# EAGLE design integrated_v3 (EAGLE 9.6.2)
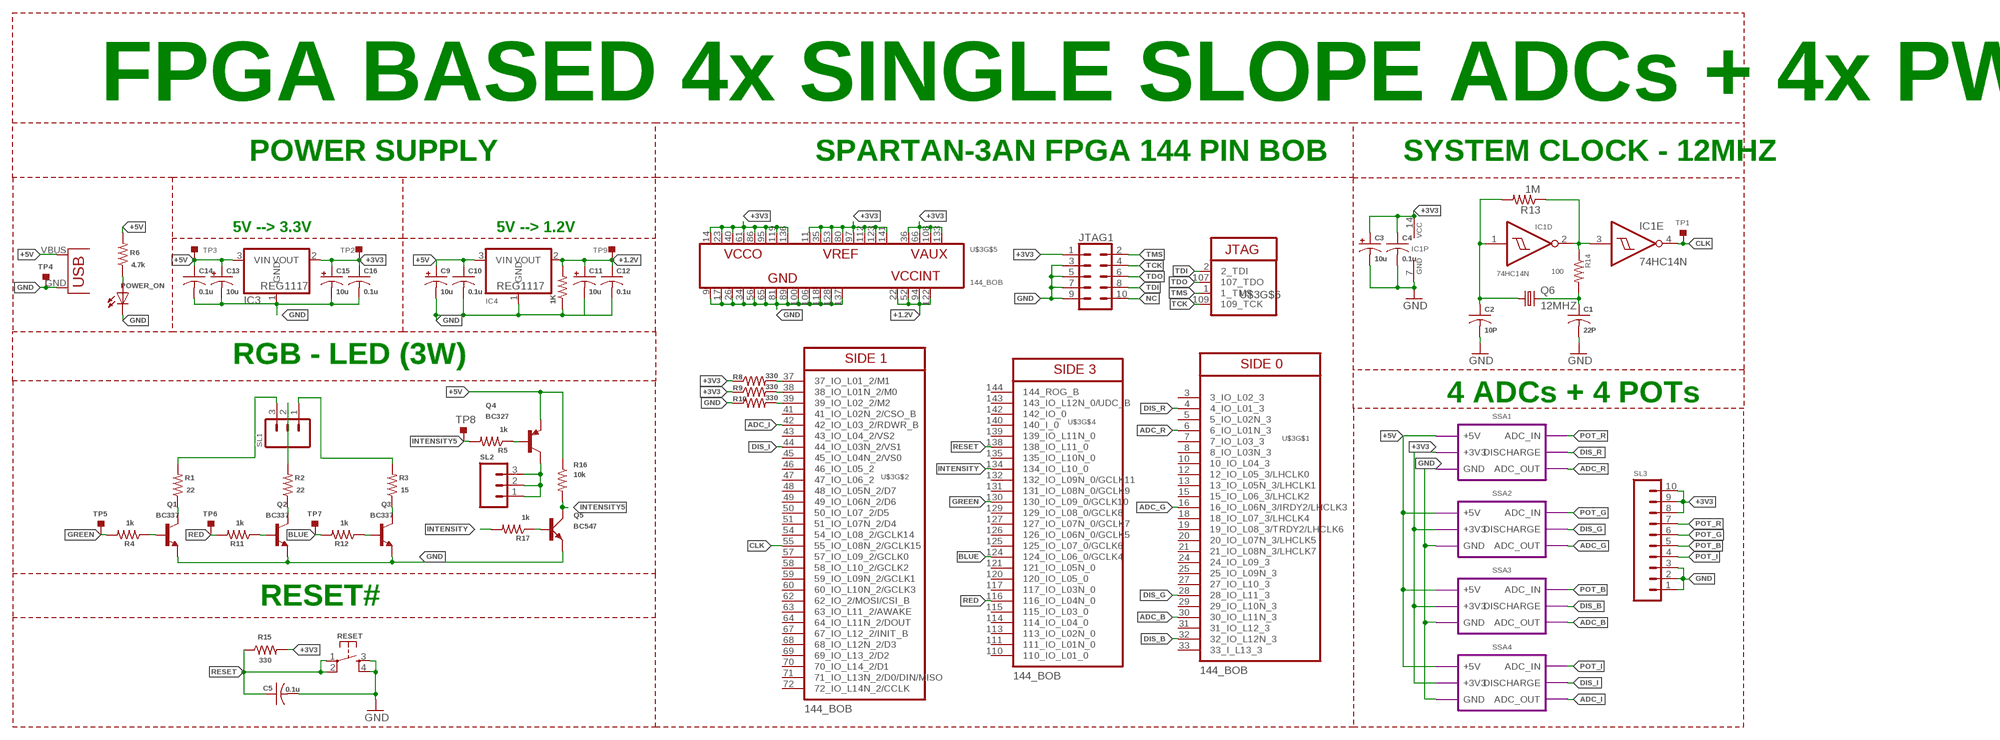
[diagram p0: schematic, sheet 1]

## Parts
1K  R-US_0204/7  [0204/7]
C1  22P  CAP0603  [C0603]
C2  10P  CAP0603  [C0603]
C3  10u  CAP_POL_16V  [B/3528-21R]
C4  0.1u  CAP0603  [C0603]
C5  0.1u  CAP0603  [C0603]
C9  10u  CAP_POL_16V  [B/3528-21R]
C10  0.1u  CAP0603  [C0603]
C11  10u  CAP_POL_16V  [B/3528-21R]
C12  0.1u  CAP0603  [C0603]
C13  10u  CAP_POL_16V  [B/3528-21R]
C14  0.1u  CAP0603  [C0603]
C15  10u  CAP_POL_16V  [B/3528-21R]
C16  0.1u  CAP0603  [C0603]
IC1  74HC14N  [DIL14]
IC3  REG1117  [SOT223]
IC4  REG1117  [SOT223]
JTAG1  CONN_05X2  [2X5-SHROUDED_LOCK_PROPER]
POWER_ON  LED3MM  [LED3MM]
Q1  BC337  [TO92]
Q2  BC337  [TO92]
Q3  BC337  [TO92]
Q4  BC327  [TO92]
Q5  BC547  [SOT54A]
Q6  12MHZ  CRYSTALHC49US  [HC49US]
R1  22  R-US_0411/15  [0411/15]
R2  22  R-US_0411/15  [0411/15]
R3  15  R-US_0411/15  [0411/15]
R4  1k  R-US_0204/7  [0204/7]
R5  1k  R-US_0204/7  [0204/7]
R6  4.7k  R-US_0204/7  [0204/7]
R8  330  RESISTOR0805  [R0805]
R9  330  RESISTOR0805  [R0805]
R10  330  RESISTOR0805  [R0805]
R11  1k  R-US_0204/7  [0204/7]
R12  1k  R-US_0204/7  [0204/7]
R13  1M  R-US_M0805  [M0805]
R14  100  R-US_M0805  [M0805]
R15  330  R-US_0204/7  [0204/7]
R16  10k  R-US_0204/7  [0204/7]
R17  1k  R-US_0204/7  [0204/7]
RESET  10xx  OMRON_SWITCH_10-XX  [B3F-10XX]
SL1  M03  [03P]
SL2  M03  [03P]
SL3  M10  [10P]
TP1  TESTPOINT_TPS-SMD-10SN  [TESTPOINT_SMD-10SN]
TP2  TESTPOINT_TPS-SMD-10SN  [TESTPOINT_SMD-10SN]
TP3  TESTPOINT_TPS-SMD-10SN  [TESTPOINT_SMD-10SN]
TP4  TESTPOINT_TPS-SMD-10SN  [TESTPOINT_SMD-10SN]
TP5  TESTPOINT_TPS-SMD-10SN  [TESTPOINT_SMD-10SN]
TP6  TESTPOINT_TPS-SMD-10SN  [TESTPOINT_SMD-10SN]
TP7  TESTPOINT_TPS-SMD-10SN  [TESTPOINT_SMD-10SN]
TP8  TESTPOINT_TPS-SMD-10SN  [TESTPOINT_SMD-10SN]
TP9  TESTPOINT_TPS-SMD-10SN  [TESTPOINT_SMD-10SN]
U$3  144_BOB  [144_BOB]
U$4  USB(POWER)  [USB(POWER)]

## Module instances
SSA1 = SINGLESLOPEADC
SSA2 = SINGLESLOPEADC
SSA3 = SINGLESLOPEADC
SSA4 = SINGLESLOPEADC

## Nets
+1.2V: 1K.2 C11.+ C12.1 IC4.2(VOUT) TP9.TP U$3.22(22_VCCINT) U$3.52(52_VCCINT) U$3.94(94_VCCINT) U$3.122(122_VCCINT)
+3V3: C3.+ C4.1 C15.+ C16.1 IC1.14(P:VCC) IC3.2(VOUT) JTAG1.1 R8.1 R9.1 R15.2 SL3.8 SL3.9 SL3.10 TP2.TP U$3.11(11_VREF) U$3.14(14_VCCO) U$3.23(23_VCCO) U$3.35(35_VREF) U$3.36(36_VAUX) U$3.40(40_VCCO) U$3.53(53_VREF) U$3.61(61_VCCO) U$3.66(66_VAUX) U$3.80(80_VREF) U$3.86(86_VCCO) U$3.95(95_VCCO) U$3.97(97_VREF) U$3.108(108_VAUX) U$3.112(112_VREF) U$3.119(119_VCCO) U$3.123(123_VREF) U$3.133(133_VAUX) U$3.136(136_VCCO) U$3.141(141_VREF) ; port SSA1.+3V3 SSA2.+3V3 SSA3.+3V3 SSA4.+3V3
+5V: C9.+ C10.1 C13.+ C14.1 IC3.3(VIN) IC4.3(VIN) Q4.1(E) R6.2 R16.1 TP3.TP U$4.VBUS(VCC) ; port SSA1.+5V SSA2.+5V SSA3.+5V SSA4.+5V
ADC_B: U$3.30(30_IO_L11N_3) ; port SSA3.ADC_OUT
ADC_G: U$3.16(16_IO_L06N_3/IRDY2/LHCLK3) ; port SSA2.ADC_OUT
ADC_I: U$3.42(42_IO_L03_2/RDWR_B) ; port SSA4.ADC_OUT
ADC_R: U$3.6(6_IO_L01N_3) ; port SSA1.ADC_OUT
BLUE: R12.2 TP7.TP U$3.124(124_IO_L06_0/GCLK4)
CLK: IC1.4(E:O) TP1.TP U$3.55(55_IO_L08N_2/GCLK15)
DIS_B: U$3.32(32_IO_L12N_3) ; port SSA3.DISCHARGE
DIS_G: U$3.28(28_IO_L11_3) ; port SSA2.DISCHARGE
DIS_I: U$3.44(44_IO_L03N_2/VS1) ; port SSA4.DISCHARGE
DIS_R: U$3.4(4_IO_L01_3) ; port SSA1.DISCHARGE
GND: 1K.1 C1.2 C2.2 C3.- C4.2 C5.2 C9.- C10.2 C11.- C12.2 C13.- C14.2 C15.- C16.2 IC1.7(P:GND) IC3.1(GND) IC4.1(GND) JTAG1.3 JTAG1.5 JTAG1.7 JTAG1.9 POWER_ON.K(C) Q1.1(E) Q2.1(E) Q3.1(E) Q5.E R10.1 RESET.3(S) RESET.4(S1) SL3.1 SL3.2 SL3.3 TP4.TP U$3.9(9_GND) U$3.17(17_GND) U$3.26(26_GND) U$3.34(34_GND) U$3.56(56_GND) U$3.65(65_GND) U$3.81(81_GND) U$3.89(89_GND) U$3.100(100_GND) U$3.106(106_GND) U$3.118(118_GND) U$3.128(128_GND) U$3.137(137_GND) U$4.GND ; port SSA1.GND SSA3.GND SSA4.GND SSA2.GND
GREEN: R4.2 TP5.TP U$3.130(130_IO_L09_0/GCLK10)
INTENSITY: R17.2 U$3.134(134_IO_L10_0)
INTENSITY5: Q5.C R5.2 R16.2 TP8.TP
N$1: Q1.3(C) R1.1
N$2: R1.2 SL1.3
N$3: Q2.3(C) R2.1
N$4: C2.1 IC1.1(D:I) Q6.1 R13.2
N$6: Q5.B R17.1
N$7: Q3.3(C) R3.1
N$10: R3.2 SL1.1
N$13: Q1.2(B) R4.1
N$16: Q2.2(B) R11.1
N$17: Q3.2(B) R12.1
N$18: R2.2 SL1.2
N$19: IC1.2(D:O) IC1.3(E:I) R13.1 R14.1
N$20: C1.1 Q6.2 R14.2
N$21: Q4.2(B) R5.1
N$23: Q4.3(C) SL2.1 SL2.2 SL2.3
N$24: POWER_ON.A R6.1
N$25: R8.2 U$3.37(37_IO_L01_2/M1)
N$26: R9.2 U$3.38(38_IO_L01N_2/M0)
N$27: R10.2 U$3.39(39_IO_L02_2/M2)
NC: JTAG1.10
POT_B: SL3.5 ; port SSA3.ADC_IN
POT_G: SL3.6 ; port SSA2.ADC_IN
POT_I: SL3.4 ; port SSA4.ADC_IN
POT_R: SL3.7 ; port SSA1.ADC_IN
RED: R11.2 TP6.TP U$3.116(116_IO_L04N_0)
RESET: C5.1 R15.1 RESET.1(P) RESET.2(P1) U$3.138(138_IO_L11_0)
TCK: JTAG1.4 U$3.109(109_TCK)
TDI: JTAG1.8 U$3.2(2_TDI)
TDO: JTAG1.6 U$3.107(107_TDO)
TMS: JTAG1.2 U$3.1(1_TMS)
Unconnected: IC1.5(F:I) IC1.6(F:O) IC1.8(C:O) IC1.9(C:I) IC1.10(B:O) IC1.11(B:I) IC1.12(A:O) IC1.13(A:I) U$3.3(3_IO_L02_3) U$3.5(5_IO_L02N_3) U$3.7(7_IO_L03_3) U$3.8(8_IO_L03N_3) U$3.10(10_IO_L04_3) U$3.12(12_IO_L05_3/LHCLK0) U$3.13(13_IO_L05N_3/LHCLK1) U$3.15(15_IO_L06_3/LHCLK2) U$3.18(18_IO_L07_3/LHCLK4) U$3.19(19_IO_L08_3/TRDY2/LHCLK6) U$3.20(20_IO_L07N_3/LHCLK5) U$3.21(21_IO_L08N_3/LHCLK7) U$3.24(24_IO_L09_3) U$3.25(25_IO_L09N_3) U$3.27(27_IO_L10_3) U$3.29(29_IO_L10N_3) U$3.31(31_IO_L12_3) U$3.33(33_I_L13_3) U$3.41(41_IO_L02N_2/CSO_B) U$3.43(43_IO_L04_2/VS2) U$3.45(45_IO_L04N_2/VS0) U$3.46(46_IO_L05_2) U$3.47(47_IO_L06_2) U$3.48(48_IO_L05N_2/D7) U$3.49(49_IO_L06N_2/D6) U$3.50(50_IO_L07_2/D5) U$3.51(51_IO_L07N_2/D4) U$3.54(54_IO_L08_2/GCLK14) U$3.57(57_IO_L09_2/GCLK0) U$3.58(58_IO_L10_2/GCLK2) U$3.59(59_IO_L09N_2/GCLK1) U$3.60(60_IO_L10N_2/GCLK3) U$3.62(62_IO_2/MOSI/CSI_B) U$3.63(63_IO_L11_2/AWAKE) U$3.64(64_IO_L11N_2/DOUT) U$3.67(67_IO_L12_2/INIT_B) U$3.68(68_IO_L12N_2/D3) U$3.69(69_IO_L13_2/D2) U$3.70(70_IO_L14_2/D1) U$3.71(71_IO_L13N_2/D0/DIN/MISO) U$3.72(72_IO_L14N_2/CCLK) U$3.73(73_DONE) U$3.74(74_SUSEND) U$3.75(75_IO_L02_1/LDC1) U$3.76(76_IO_L01_1/HDC) U$3.77(77_IO_L02N_1/LDC0) U$3.78(78_IO_L01N_1/LDC2) U$3.79(79_IO_1) U$3.82(82_IO_L03_1) U$3.83(83_IO_L04_1/RHCLK0) U$3.84(84_IO_L03N_1) U$3.85(85_IO_L04N_1/RHCLK1) U$3.87(87_IO_L05_1/RHCLK2) U$3.88(88_IO_L05N_1/TRDY1/RHCLK3) U$3.90(90_IO_L06_1/RHCLK4) U$3.91(91_IO_L07_1/IRDY1/RHCLK6) U$3.92(92_IO_L06N_1/RHCLK5) U$3.93(93_IO_L07N_1/RHCLK7) U$3.96(96_IO_L08_1) U$3.98(98_IO_L08N_1) U$3.99(99_IO_L09_1) U$3.101(101_IO_L09N_1) U$3.102(102_IO_L10_1) U$3.103(103_IO_L11_1) U$3.104(104_IO_L10N_1) U$3.105(105_IO_L11N_1) U$3.110(110_IO_L01_0) U$3.111(111_IO_L01N_0) U$3.113(113_IO_L02N_0) U$3.114(114_IO_L04_0) U$3.115(115_IO_L03_0) U$3.117(117_IO_L03N_0) U$3.120(120_IO_L05_0) U$3.121(121_IO_L05N_0) U$3.125(125_IO_L07_0/GCLK6) U$3.126(126_IO_L06N_0/GCLK5) U$3.127(127_IO_L07N_0/GCLK7) U$3.129(129_IO_L08_0/GCLK8) U$3.131(131_IO_L08N_0/GCLK9) U$3.132(132_IO_L09N_0/GCLK11) U$3.135(135_IO_L10N_0) U$3.139(139_IO_L11N_0) U$3.140(140_I_0) U$3.142(142_IO_0) U$3.143(143_IO_L12N_0/UDC_B) U$3.144(144_ROG_B)

## Notes on the sheet
- FPGA BASED 4x SINGLE SLOPE ADCs + 4x PWM
- POWER SUPPLY | SPARTAN-3AN FPGA 144 PIN BOB | SYSTEM CLOCK - 12MHZ
- 5V --> 3.3V | 5V --> 1.2V
- RGB - LED (3W)
- 4 ADCs + 4 POTs
- RESET#

## Library data of the parts
1K R4-R6 R11-R17 = rcl:R-US_: RESISTOR, American symbol; SPICEPREFIX: R
C1 C2 C4 C5 C10 C12 C14 C16 = CEDT_JANUARY_2015_v5:CAP
C3 C9 C11 C13 C15 = CEDT_JANUARY_2015_v5:CAP_POL
IC1 = 74xx-eu:74*14: Hex schmitt trigger INVERTER
IC3 IC4 = CEDT_JANUARY_2015_v5:REG1117: 800mA and 1A Low Dropout (LDO) Positive Regulator 1.8V, 2.5V, 2.85V, 3.3V, 5V, and Adj
JTAG1 = SparkFun-Connectors_v3:CONN_05X2: Multi connection point. Often used as Generic Header-pin footprint for 0.1 inch spaced/style header connections For AVR SPI programming port, see special device with nice symbol: "AVR_SPI_PROG_5x2.dev" You can populate with any combo of single row headers, but if you'd like an exact match, check these: 2x5 AVR ICSP Male Header <https://www.sparkfun.com/products/778> (PRT-00778) 2x5 Pin Shrouded Header <https://www.sparkfun.com/products/8506> (PRT-08506) On any of the 0.1 inch spaced packages, you can populate with these: Break Away Headers - Straight <https://www.sparkfun.com/products/116> (PRT-00116) Break Away Male Headers - Right Angle <https://www.sparkfun.com/products/553> (PRT-00553) Female Headers <https://www.sparkfun.com/products/115> (PRT-00115) Break Away Headers - Machine Pin <https://www.sparkfun.com/products/117> (PRT-00117) Break Away Female Headers - Swiss Machine Pin <https://www.sparkfun.com/products/743> (PRT-00743) Special note: the shrouded connector mates well with our 5x2 ribbon cables: 2x5 Pin IDC Ribbon Cable <https://www.sparkfun.com/products/8535> (PRT-08535)
POWER_ON = CEDT_JANUARY_2015_v5:LED
Q1-Q3 = transistor-npn:BC337*: NPN Transistor
Q4 = transistor-pnp:BC327: PNP Transistor
Q5 = transistor-small-signal:BC547: NPN TRANSISTOR
Q6 = CEDT_JANUARY_2015_v5:CRYSTAL: Crystals Various standard crystals. Proven footprints. Spark Fun Electronics SKU : COM-00534
R1-R3 = resistor:R-US_: RESISTOR, American symbol
R8-R10 = CEDT_JANUARY_2015_v5:RESISTOR
RESET = CEDT_JANUARY_2015_v5:OMRON_SWITCH
SL1 SL2 = con-amp-quick:M03: AMP QUICK CONNECTOR; OC_FARNELL: unknown; OC_NEWARK: unknown
SL3 = con-amp-quick:M10: AMP QUICK CONNECTOR; OC_FARNELL: unknown; OC_NEWARK: unknown
TP1-TP9 = 52101-101-REV-A_v16:TESTPOINT_TPS: TEST POINT PAD; BOM: EXCLUDE
U$3 = Suprio_Lib:144_BOB
U$4 = CEDT_JANUARY_2015_v5:USB(POWER)

## Module SINGLESLOPEADC
Ports: +5V(pwr) +3V3(pwr) GND(pwr) ADC_IN(in) DISCHARGE(in) ADC_OUT(out)
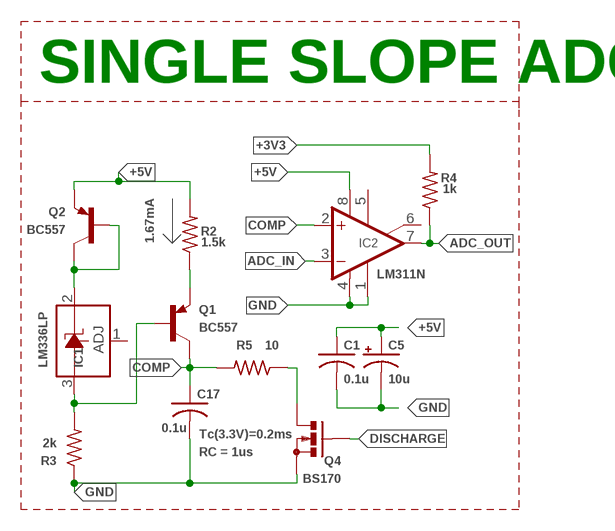
[diagram p1: schematic, module SINGLESLOPEADC, sheet 1]

### Parts
C1  0.1u  CAP0603  [C0603]
C5  10u  CAP_POL_16V  [B/3528-21R]
C17  0.1u  CAP0603  [C0603]
IC1  LM336LP  [TO92]
IC2  LM311N  [DIL08]
Q1  BC557  PNP_BC557*TO92  [TO92]
Q2  BC557  PNP_BC557*TO92  [TO92]
Q4  BS170  [SOT54E]
R2  1.5k  R-US_0204/7  [0204/7]
R3  2k  R-US_0204/7  [0204/7]
R4  1k  R-US_0204/7  [0204/7]
R5  10  RESISTOR0207/7  [0207/7]

### Nets
+3V3: R4.2
+5V: C1.1 C5.+ IC2.8(V+) Q2.3(E) R2.2
ADC_IN: IC2.3(-IN)
ADC_OUT: IC2.7(OUT) R4.1
COMP: C17.1 IC2.2(+IN) Q1.1(C) R5.2
DISCHARGE: Q4.G
GND: C1.2 C5.- C17.2 IC2.1(GND) IC2.4(V-) Q4.S R3.1
N$2: Q1.3(E) R2.1
N$3: IC1.2(C) Q2.1(C) Q2.2(B)
N$4: IC1.3(A) Q1.2(B) R3.2
N$5: Q4.D R5.1
Unconnected: IC1.1(ADJ) IC2.5(ON) IC2.6(ON/STR)

### Notes on the sheet
- SINGLE SLOPE ADC
- 1.67mA
- Tc(3.3V)=0.2ms
- RC = 1us

### Library data of the parts
C1 C17 = CEDT_JANUARY_2015_v5:CAP
C5 = CEDT_JANUARY_2015_v5:CAP_POL
IC1 = linear:LM336: 2.5-V INTEGRATED REFERENCE CIRCUITS LM236 Source: http://focus.ti.com/lit/ds/symlink/lm336-2.5.pdf
IC2 = linear:LM311: COMPARATOR
Q1 Q2 = Transistor:PNP_: PNP - Popular parts; CATEGORY: Transistor; SUB-CATEGORY: BJT; TYPE: PNP
Q4 = transistor-small-signal:BS170: N-CHANNEL MOS FET
R2-R4 = rcl:R-US_: RESISTOR, American symbol; SPICEPREFIX: R
R5 = CEDT_JANUARY_2015_v5 (1):RESISTOR

## Net classes
0 default: width 0.406 mm
1 POWER: width 0.61 mm, drill 0.7 mm, clearance 0.25 mm

## Board
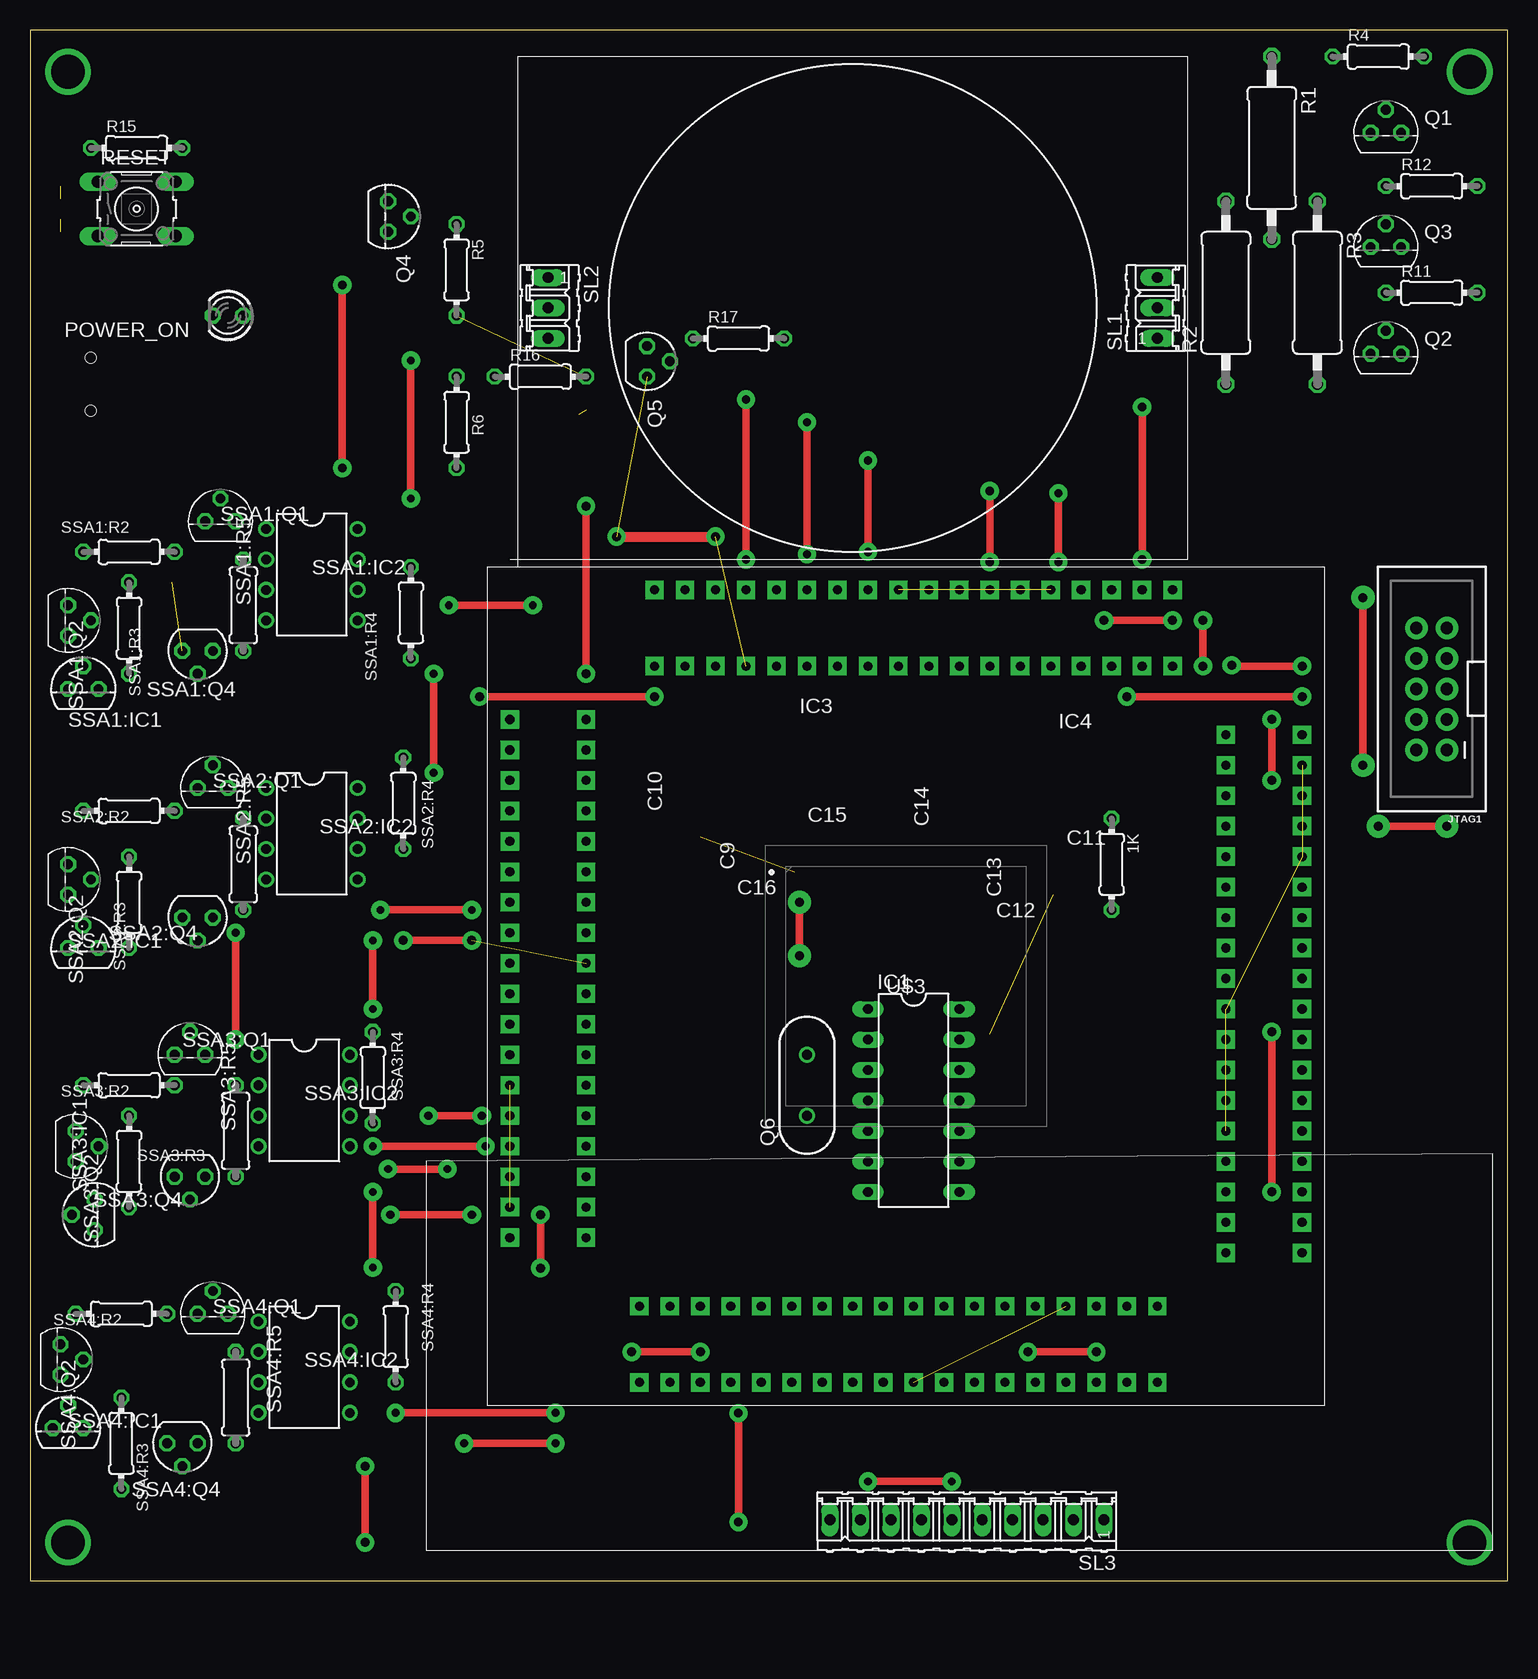
[diagram p2: board, top side]
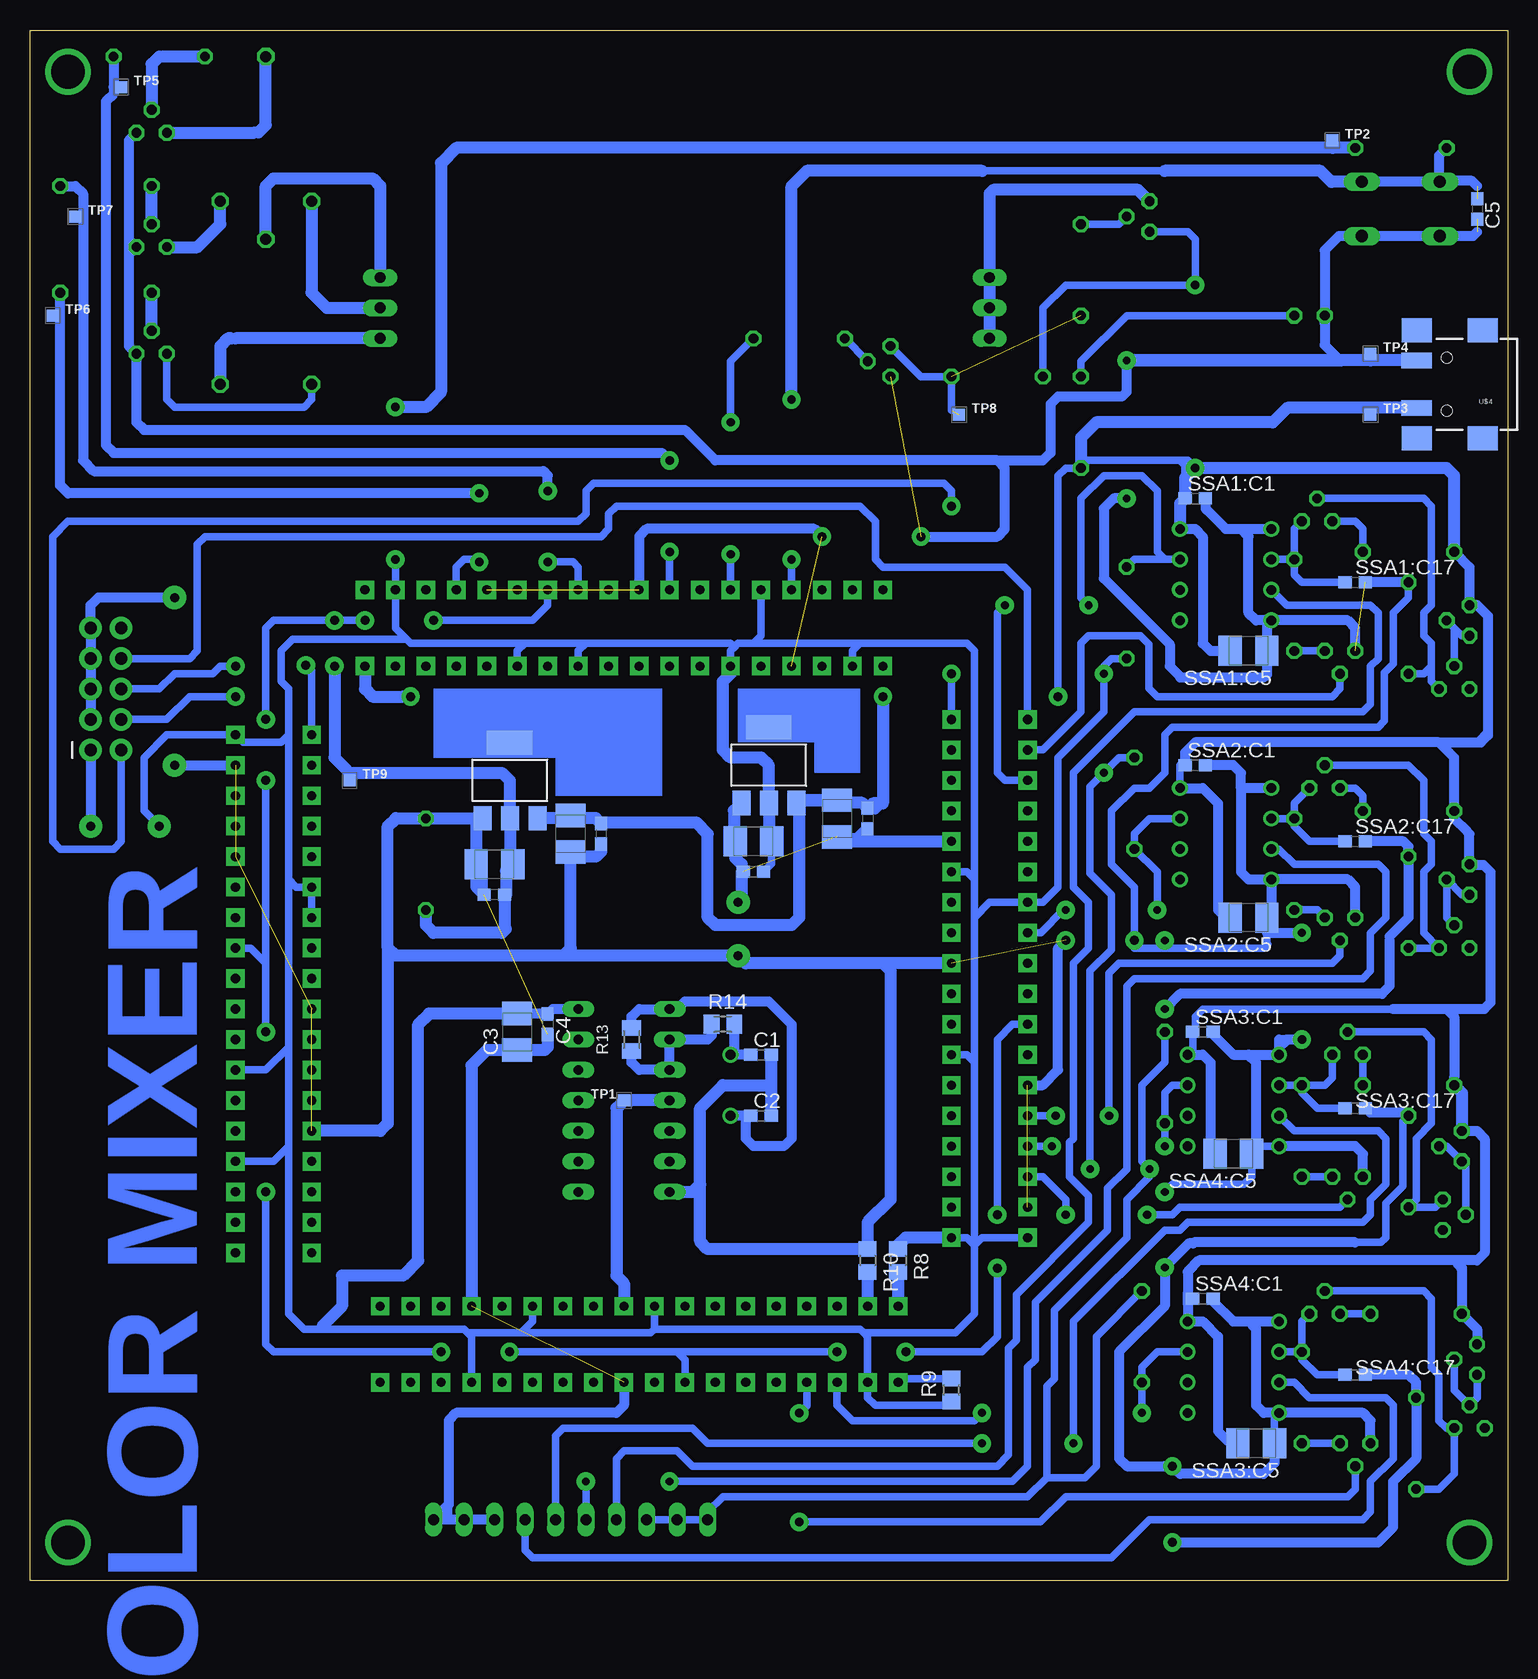
[diagram p3: board, bottom side, seen from below]

Size 123.17 x 129.21 mm. Coordinates in mm from the lower left corner, seen from the top.
Outline: 0,0 123.17,0 123.17,129.21 0,129.21 0,0
Copper layers (1*16): Top 0.035mm / dielectric 1.5mm / Bottom 0.035mm
Design rules "default *": minimum track width 6mil, minimum drill 0.35mm, track to track 16mil, track to pad 18mil, pad to pad 16mil, via to via 16mil, smd to smd 16mil, copper to edge 40mil, drill to drill 6mil, minimum pad ring 10mil, minimum via ring 8mil, stop-mask expansion 4mil, vias tented up to drill 0mil, thermal gap 10mil

### Footprints (pad centres in the part's own frame; a part is rotated, then mirrored left to right if it is on the bottom)
0204/7 = drill 0.813 octagon: 1 -3.81,0; 2 3.81,0
C0603 = smd 1.1 x 1: 1 -0.85,0; 2 0.85,0
B/3528-21R = smd 1.95 x 2.5: + 1.525,0; - -1.525,0
DIL14 = drill 0.813 long: 1 -7.62,-3.81; 2 -5.08,-3.81; 3 -2.54,-3.81; 4 0,-3.81; 5 2.54,-3.81; 6 5.08,-3.81; 7 7.62,-3.81; 8 7.62,3.81; 9 5.08,3.81; 10 2.54,3.81; 11 0,3.81; 12 -2.54,3.81; 13 -5.08,3.81; 14 -7.62,3.81
SOT223 = smd 1.499 x 2.007: 1 -2.261,-3.15; 2 0.025,-3.15; 3 2.311,-3.15 | smd 3.81 x 2.007: 4 0,3.15
2X5-SHROUDED_LOCK_PROPER = drill 1.016 pad 1.88: 1 -1.27,5.08; 2 1.27,5.08; 3 -1.27,2.54; 4 1.27,2.54; 5 -1.27,0; 6 1.27,0; 7 -1.27,-2.54; 8 1.27,-2.54; 9 -1.27,-5.08; 10 1.27,-5.08
LED3MM = drill 0.813 octagon: A -1.27,0; K 1.27,0
TO92 = drill 0.813 octagon: 1 1.27,0; 2 0,1.905; 3 -1.27,0
SOT54A = drill 0.813 octagon: B 0,1.905; C -1.27,0; E 1.27,0
HC49US = drill 0.813: 1 -2.54,0; 2 2.54,0
0411/15 = drill 0.914 octagon: 1 -7.62,0; 2 7.62,0
R0805 = smd 1.3 x 1.5: 1 -0.95,0; 2 0.95,0
M0805 = smd 1.3 x 1.6: 1 -0.95,0; 2 0.95,0
B3F-10XX = drill 1.016 long: 1 -3.251,2.261; 2 3.251,2.261; 3 -3.251,-2.261; 4 3.251,-2.261
03P = drill 0.914 long: 1 -2.54,0; 2 0,0; 3 2.54,0
10P = drill 0.914 long: 1 -11.43,0; 2 -8.89,0; 3 -6.35,0; 4 -3.81,0; 5 -1.27,0; 6 1.27,0; 7 3.81,0; 8 6.35,0; 9 8.89,0; 10 11.43,0
TO92' = drill 0.813 octagon: 1 -1.27,0; 2 0,1.905; 3 1.27,0
DIL08 = drill 0.813 pad 1.27: 1 -3.81,-3.81; 2 -1.27,-3.81; 3 1.27,-3.81; 4 3.81,-3.81; 5 3.81,3.81; 6 1.27,3.81; 7 -1.27,3.81; 8 -3.81,3.81
SOT54E = drill 0.813 octagon: D -1.27,0; G 0,1.905; S 1.27,0
0207/7 = drill 0.813 octagon: 1 -3.81,0; 2 3.81,0
TESTPOINT_SMD-10SN = smd 1 x 1: TP 0,0
144_BOB = drill 0.762 pad 1.524 square: 1 -26.67,21.59; 2 -33.02,21.59; 3 -26.67,19.05; 4 -33.02,19.05; 5 -26.67,16.51; 6 -33.02,16.51; 7 -26.67,13.97; 8 -33.02,13.97; 9 -26.67,11.43; 10 -33.02,11.43; 11 -26.67,8.89; 12 -33.02,8.89; 13 -26.67,6.35; 14 -33.02,6.35; 15 -26.67,3.81; 16 -33.02,3.81; 17 -26.67,1.27; 18 -33.02,1.27; 19 -26.67,-1.27; 20 -33.02,-1.27; 21 -26.67,-3.81; 22 -33.02,-3.81; 23 -26.67,-6.35; 24 -33.02,-6.35; 25 -26.67,-8.89; 26 -33.02,-8.89; 27 -26.67,-11.43; 28 -33.02,-11.43; 29 -26.67,-13.97; 30 -33.02,-13.97; 31 -26.67,-16.51; 32 -33.02,-16.51; 33 -26.67,-19.05; 34 -33.02,-19.05; 35 -26.67,-21.59; 36 -33.02,-21.59; 37 -22.225,-27.305; 38 -22.225,-33.655; 39 -19.685,-27.305; 40 -19.685,-33.655; 41 -17.145,-27.305; 42 -17.145,-33.655; 43 -14.605,-27.305; 44 -14.605,-33.655; 45 -12.065,-27.305; 46 -12.065,-33.655; 47 -9.525,-27.305; 48 -9.525,-33.655; 49 -6.985,-27.305; 50 -6.985,-33.655; 51 -4.445,-27.305; 52 -4.445,-33.655; 53 -1.905,-27.305; 54 -1.905,-33.655; 55 0.635,-27.305; 56 0.635,-33.655; 57 3.175,-27.305; 58 3.175,-33.655; 59 5.715,-27.305; 60 5.715,-33.655; 61 8.255,-27.305; 62 8.255,-33.655; 63 10.795,-27.305; 64 10.795,-33.655; 65 13.335,-27.305; 66 13.335,-33.655; 67 15.875,-27.305; 68 15.875,-33.655; 69 18.415,-27.305; 70 18.415,-33.655; 71 20.955,-27.305; 72 20.955,-33.655; 73 26.67,-22.86; 74 33.02,-22.86; 75 26.67,-20.32; 76 33.02,-20.32; 77 26.67,-17.78; 78 33.02,-17.78; 79 26.67,-15.24; 80 33.02,-15.24; 81 26.67,-12.7; 82 33.02,-12.7; 83 26.67,-10.16; 84 33.02,-10.16; 85 26.67,-7.62; 86 33.02,-7.62; 87 26.67,-5.08; 88 33.02,-5.08; 89 26.67,-2.54; 90 33.02,-2.54; 91 26.67,0; 92 33.02,0; 93 26.67,2.54; 94 33.02,2.54; 95 26.67,5.08; 96 33.02,5.08; 97 26.67,7.62; 98 33.02,7.62; 99 26.67,10.16; 100 33.02,10.16; 101 26.67,12.7; 102 33.02,12.7; 103 26.67,15.24; 104 33.02,15.24; 105 26.67,17.78; 106 33.02,17.78; 107 26.67,20.32; 108 33.02,20.32; 109 22.225,26.035; 110 22.225,32.385; 111 19.685,26.035; 112 19.685,32.385; 113 17.145,26.035; 114 17.145,32.385; 115 14.605,26.035; 116 14.605,32.385; 117 12.065,26.035; 118 12.065,32.385; 119 9.525,26.035; 120 9.525,32.385; 121 6.985,26.035; 122 6.985,32.385; 123 4.445,26.035; 124 4.445,32.385; 125 1.905,26.035; 126 1.905,32.385; 127 -0.635,26.035; 128 -0.635,32.385; 129 -3.175,26.035; 130 -3.175,32.385; 131 -5.715,26.035; 132 -5.715,32.385; 133 -8.255,26.035; 134 -8.255,32.385; 135 -10.795,26.035; 136 -10.795,32.385; 137 -13.335,26.035; 138 -13.335,32.385; 139 -15.875,26.035; 140 -15.875,32.385; 141 -18.415,26.035; 142 -18.415,32.385; 143 -20.955,26.035; 144 -20.955,32.385
USB(POWER) = smd 2.54 x 1.27: GND 2.5,-1.981; VBUS 2.5,1.981 | smd 2.5 x 2: GND@1 -3,-4.5; GND@2 -3,4.5; GND@3 2.5,4.5; GND@4 2.5,-4.5 | hole 0.9: 0,2.2; 0,-2.2

### Placement (x,y rotation side)
1K  90.17,59.69 270 top
C1  62.23,43.81 0 bottom
C2  62.23,38.73 0 bottom
C3  82.55,45.72 90 bottom
C4  80.01,46.35 270 bottom
C5  2.54,114.3 270 bottom
C9  55.88,63.5 90 bottom
C10  53.34,63.5 270 bottom
C11  84.45,59.69 0 bottom
C12  84.45,57.15 180 bottom
C13  78.11,62.23 90 bottom
C14  75.56,62.23 270 bottom
C15  62.86,61.59 0 bottom
C16  62.86,59.05 180 bottom
IC1  73.66,40.01 270 top
IC3  61.59,67.94 0 bottom
IC4  83.18,66.67 0 bottom
JTAG1  116.84,74.3 180 top
POWER_ON  16.51,105.41 180 top
Q1  113.03,120.65 0 top
Q2  113.03,102.23 0 top
Q3  113.03,111.12 0 top
Q4  29.84,113.67 270 top
Q5  51.43,101.6 270 top
Q6  64.77,41.27 90 top
R1  103.51,119.38 270 top
R2  99.7,107.31 90 top
R3  107.31,107.31 270 top
R4  112.39,127 0 top
R5  35.56,109.22 270 top
R6  35.56,96.52 270 top
R8  50.8,26.67 270 bottom
R9  46.36,15.88 90 bottom
R10  53.34,26.67 270 bottom
R11  116.84,107.31 0 top
R12  116.84,116.2 0 top
R13  73.02,45.09 90 bottom
R14  65.4,46.35 0 bottom
R15  8.89,119.38 0 top
R16  42.55,100.33 0 top
R17  59.05,103.5 0 top
RESET  8.89,114.3 0 top
SL1  93.98,106.05 90 top
SL2  43.18,106.05 270 top
SL3  78.11,5.08 180 top
SSA1:C1  0.1u  [C0603]  26.04,90.17 0 bottom
SSA1:C5  10u  [B/3528-21R]  21.59,77.47 180 bottom
SSA1:C17  0.1u  [C0603]  12.7,83.19 0 bottom
SSA1:IC1  LM336LP  [TO92']  4.44,74.3 0 top
SSA1:IC2  LM311N  [DIL08]  23.49,83.82 270 top
SSA1:Q1  BC557  [TO92]  15.88,88.27 0 top
SSA1:Q2  BC557  [TO92]  3.17,80.01 270 top
SSA1:Q4  BS170  [SOT54E]  13.97,77.47 180 top
SSA1:R2  1.5k  [0204/7]  8.25,85.72 180 top
SSA1:R3  2k  [0204/7]  8.25,79.38 270 top
SSA1:R4  1k  [0204/7]  31.75,80.64 270 top
SSA1:R5  10  [0207/7]  17.78,81.28 90 top
SSA2:C1  0.1u  [C0603]  26.04,67.94 0 bottom
SSA2:C5  10u  [B/3528-21R]  21.59,55.24 180 bottom
SSA2:C17  0.1u  [C0603]  12.7,61.59 0 bottom
SSA2:IC1  LM336LP  [TO92']  4.44,52.7 0 top
SSA2:IC2  LM311N  [DIL08]  23.49,62.23 270 top
SSA2:Q1  BC557  [TO92]  15.24,66.04 0 top
SSA2:Q2  BC557  [TO92]  3.17,58.42 270 top
SSA2:Q4  BS170  [SOT54E]  13.97,55.24 180 top
SSA2:R2  1.5k  [0204/7]  8.25,64.14 180 top
SSA2:R3  2k  [0204/7]  8.25,56.52 270 top
SSA2:R4  1k  [0204/7]  31.11,64.77 90 top
SSA2:R5  10  [0207/7]  17.78,59.69 90 top
SSA3:C1  0.1u  [C0603]  25.4,45.72 0 bottom
SSA3:C5  10u  [B/3528-21R]  20.95,11.43 180 bottom
SSA3:C17  0.1u  [C0603]  12.7,39.37 0 bottom
SSA3:IC1  LM336LP  [TO92']  5.4,30.48 90 top
SSA3:IC2  LM311N  [DIL08]  22.86,40.01 270 top
SSA3:Q1  BC557  [TO92]  13.33,43.81 0 top
SSA3:Q2  BC557  [TO92]  3.81,36.2 270 top
SSA3:Q4  BS170  [SOT54E]  13.33,33.66 180 top
SSA3:R2  1.5k  [0204/7]  8.25,41.27 180 top
SSA3:R3  2k  [0204/7]  8.25,34.92 270 top
SSA3:R4  1k  [0204/7]  28.58,41.91 90 top
SSA3:R5  10  [0207/7]  17.14,37.47 90 top
SSA4:C1  0.1u  [C0603]  25.4,23.5 0 bottom
SSA4:C5  10u  [B/3528-21R]  22.86,35.56 180 bottom
SSA4:C17  0.1u  [C0603]  12.7,17.14 0 bottom
SSA4:IC1  LM336LP  [TO92']  3.17,12.7 0 top
SSA4:IC2  LM311N  [DIL08]  22.86,17.78 270 top
SSA4:Q1  BC557  [TO92]  15.24,22.23 0 top
SSA4:Q2  BC557  [TO92]  2.54,18.41 270 top
SSA4:Q4  BS170  [SOT54E]  12.7,11.43 180 top
SSA4:R2  1.5k  [0204/7]  7.62,22.23 180 top
SSA4:R3  2k  [0204/7]  7.62,11.43 270 top
SSA4:R4  1k  [0204/7]  30.48,20.32 90 top
SSA4:R5  10  [0207/7]  17.14,15.24 90 top
TP1  73.66,40.01 0 bottom
TP2  14.61,120.02 0 bottom
TP3  11.43,97.16 0 bottom
TP4  11.43,102.23 0 bottom
TP5  115.57,124.46 0 bottom
TP6  121.29,105.41 0 bottom
TP7  119.38,113.67 0 bottom
TP8  45.72,97.16 0 bottom
TP9  96.52,66.67 0 bottom
U$3  73.02,50.16 0 top
U$4  5.08,99.69 180 bottom

### Tracks (layer width: path | path; a pad name or v marks a point on that pad's centre or on a via)
+1.2V  (via drill 0.75 pad 1.52)
  Top 0.61: v103.51,32.38 v103.51,45.72 | v103.51,66.67 v103.51,71.75 | v95.25,80.01 v89.54,80.01 | v83.18,19.05 v88.9,19.05 | v55.88,19.05 v50.17,19.05 | v42.55,26.04 v42.55,30.48 | v97.79,80.01 v97.79,76.2
  Bottom 0.61: v103.51,45.72 103.51,51.44 | 103.51,51.44 v103.51,66.67 | v103.51,71.75 103.51,79.38 102.87,80.01 v97.79,80.01 v95.25,80.01 | v89.54,80.01 81.28,80.01 80.01,81.28 U$3.122 | U$3.52 68.58,18.41 69.21,19.05 | 69.21,19.05 v83.18,19.05 | v88.9,19.05 102.87,19.05 103.51,19.68 v103.51,32.38 | 69.21,19.05 v55.88,19.05 | v50.17,19.05 43.81,19.05 42.55,20.32 v42.55,26.04 | v42.55,30.48 42.55,45.09 41.27,46.35 U$3.22 | 83.82,53.98 83.5,54.29 83.5,57.05 C12.1 83.61,59.02 C11.+ 82.93,60.33 | U$3.94 104.77,52.7 103.51,51.44 | 83.18,63.55 IC4.2 | TP9.TP 96.52,67.31 96.84,67.63
  Bottom 1.016: IC4.2 83.16,60.55 82.93,60.33 | C11.+ 83.5,59.12 83.5,57.05 | C12.1 83.61,54.4 | 83.5,54.29 83.61,54.4 | 1K.2 90.17,54.61 89.54,53.98 83.82,53.98 83.61,54.19 83.61,54.4 | v97.79,76.2 97.79,68.58 96.84,67.63 | 96.52,67.31 83.82,67.31 83.18,66.67 83.18,63.55
+3V3  (via drill 0.65 pad 1.52, 0.7 pad 1.52, 0.75 pad 1.93)
  Top 0.61: v118.11,62.87 v112.39,62.87 | v34.8,34.29 v29.84,34.29 | v92.71,97.79 v92.71,85.09 | v33.65,75.56 v33.65,67.31
  Bottom 0.61: 62.86,78.11 62.23,78.74 U$3.136 | 62.86,78.11 64.14,78.11 64.45,77.79 | 64.45,77.79 64.77,77.47 U$3.133 | 64.45,77.79 64.77,78.11 76.83,78.11 | 76.83,78.11 77.47,77.47 U$3.123 | 76.83,78.11 81.92,78.11 | 81.92,78.11 82.55,77.47 U$3.119 | 81.92,78.11 91.44,78.11 91.76,78.42 | 91.76,78.42 92.71,79.38 U$3.112 v92.71,85.09 | 91.76,78.42 101.28,78.42 102.23,77.47 102.23,74.93 101.6,74.3 101.6,70.48 | 101.6,70.48 102.23,69.85 105.41,69.85 U$3.108 111.76,70.48 113.67,68.58 113.67,64.14 v112.39,62.87 | 101.6,70.48 101.6,58.42 | 101.6,58.42 100.96,57.78 U$3.97 U$3.95 | 101.6,58.42 101.6,44.45 | 101.6,44.45 103.51,42.55 U$3.86 | 101.6,44.45 101.6,36.2 | 101.6,36.2 102.87,34.92 U$3.80 | 101.6,36.2 101.6,22.23 100.33,20.95 99.06,20.95 | 86.68,20.64 86.99,20.95 99.06,20.95 | 86.68,20.64 86.36,20.32 U$3.66 | 86.68,20.64 82.23,20.64 | U$3.61 81.28,21.59 82.23,20.64 | 82.23,20.64 71.44,20.64 71.12,20.95 | U$3.53 71.12,20.95 | 53.66,20.64 53.98,20.95 71.12,20.95 | 53.66,20.64 53.34,20.32 U$3.40 53.34,15.24 52.7,14.61 46.67,14.61 R9.1 | 53.66,20.64 46.04,20.64 44.45,22.23 44.45,27.94 | U$3.35 45.08,28.57 44.45,27.94 | 44.45,27.94 43.81,28.57 U$3.36 | 44.45,27.94 44.45,43.18 | U$3.23 45.08,43.81 44.45,43.18 | 44.45,43.18 44.45,55.24 | 44.45,55.24 43.18,56.52 U$3.14 38.73,56.52 37.46,57.78 37.46,68.58 33.65,72.39 v33.65,75.56 33.65,76.2 33.02,76.83 SSA1:R4.2 | 44.45,55.24 44.45,58.42 | 44.45,58.42 45.08,59.05 U$3.11 | 53.98,78.11 45.08,78.11 44.45,77.47 44.45,58.42 | 53.98,78.11 54.61,77.47 U$3.141 | 53.98,78.11 62.86,78.11 | C15.+ 61.34,59.73 C16.1 | 50.8,27.94 R8.1 | SSA3:R4.2 28.58,43.18 30.48,41.27 30.48,34.92 v29.84,34.29 29.84,33.66 31.75,31.75 31.75,28.57 37.78,22.54 37.78,16.83 38.42,16.19 38.42,8.57
  Bottom 0.61: v34.8,34.29 34.8,50.8 33.02,52.58 33.02,57.15 34.8,58.93 34.8,66.17 v33.65,67.31 32.39,68.58 SSA2:R4.2 | SL3.8 SL3.9 SL3.10 66.67,5.71 65.4,6.99 40.01,6.99 38.42,8.57 | SSA4:R4.2 34.29,20.32 34.29,9.53 35.24,8.57 38.42,8.57 | 98.74,21.27 99.06,20.95 | TP2.TP 14.61,119.38
  Bottom 0.813: IC1.14 79.59,47.62 C4.1 80.05,47.24 C3.+ | JTAG1.1 v118.11,62.87
  Bottom 1.016: R15.2 14.61,119.38 87.63,119.38 88.9,118.11 88.9,99.06 90.17,97.79 v92.71,97.79 | U$3.133 64.77,75.56 65.4,74.93 65.4,69.22 64.77,68.58 62.23,68.58 61.57,67.92 IC3.2 61.57,61.83 C15.+ | U$3.35 50.17,28.57 50.8,27.94 | C3.+ 89.92,47.24 90.8,46.35 90.8,26.67 92.08,25.4 97.15,25.4 97.15,22.86 98.74,21.27
+5V  (via drill 0.7 pad 1.52, 0.75 pad 1.52)
  Top 0.61: v52.07,73.66 v37.46,73.66 | v26.04,107.95 v26.04,92.71
  Bottom 0.61: IC3.3 59.05,64.8 56.11,64.8 C9.+ 54.02,65.03 C10.1 53.12,64.14 52.7,64.14 52.07,64.77 | 75.46,63.18 C14.1 | 76.01,63.52 77.87,63.52 | 77.87,63.52 78.11,63.52 IC4.3 | C13.+ 77.87,63.52 | SSA2:IC2.8 27.3,67.94 SSA2:C1.1 26.89,68.26 | 3.17,81.92 SSA1:Q2.3 | 3.17,62.23 3.33,62.39 | 4.44,41.91 SSA3:R2.2 | 4.44,26.67 25.72,26.67 | 24.13,12.7 24.13,12.45 | 24.77,36.2 24.77,35.56 SSA4:C5.+ | 27.3,93.34 34.92,93.34 R6.2 36.83,92.71 37.46,92.08 v37.46,73.66 | v26.04,92.71 26.67,93.34 27.3,93.34 | 2.54,69.85 1.64,70.75 | 1.64,80.33 1.64,80.38 | 1.91,47.62 5.08,47.62 9.52,47.62 25.4,47.62 26.04,46.99 26.04,45.94 SSA3:C1.1 26.25,44.23 SSA3:IC2.8 | 4.44,26.67 3.81,26.04 | 4.13,26.67 4.44,26.67 | Q4.1 26.67,112.39 26.04,111.76 v26.04,107.95 36.83,107.95 38.73,106.05 R16.1 | SSA1:C1.1 26.89,92.92 27.3,93.34 | 23.49,77.47 SSA1:C5.+ | 23.3,55.44 23.75,55.88 24.13,55.88 | 26.67,23.91 SSA4:C1.1 | SSA3:C5.+ 23.11,11.43 23.3,11.62 | TP3.TP 11.43,97.71
  Bottom 0.813: SSA1:IC2.8 26.04,87.63 25.4,87 25.4,78.11 24.77,77.47 23.49,77.47 | SSA2:IC2.8 25.4,66.04 24.13,64.77 24.13,55.88 23.81,55.56 | SSA2:C5.+ 23.3,55.44 | 24.13,12.7 24.13,20.32 25.4,21.59 SSA4:IC2.8 26.67,23.07 | 24.13,12.45 23.3,11.62 | SSA3:IC2.8 25.4,43.81 24.77,43.18 24.77,36.2 | SSA1:R2.2 3.17,84.45 3.17,81.92 | 5.72,69.85 4.44,68.58 SSA2:R2.2 4.44,63.5 3.33,62.39 | 5.72,69.85 2.54,69.85 2.22,69.85 1.64,70.43 1.64,70.75 1.64,80.33 | 1.64,80.38 2.54,81.28 SSA1:Q2.3 | 5.72,69.85 26.04,69.85 26.89,69 26.89,68.26 | 3.17,62.23 SSA2:Q2.3 3.12,59.64 2.01,59.64 1.42,59.05 1.42,48.16 1.91,47.68 1.91,47.62 9.52,47.62 | 5.08,47.62 4.44,46.99 4.44,41.91 | SSA3:Q2.3 2.54,37.47 1.91,36.83 1.91,27.3 2.54,26.67 4.13,26.67 | 4.13,26.67 25.72,26.67 26.67,25.72 26.67,23.91 26.67,23.07 | SSA4:C1.1 26.67,23.07 | 4.13,26.67 4.13,26.35 3.81,26.04 SSA4:R2.2 2.54,20.95 SSA4:Q2.3
  Bottom 1.016: U$4.VBUS 11.43,97.71 18.38,97.71 19.57,96.52 34.29,96.52 35.56,95.25 R6.2 | SSA1:R2.2 4.44,92.08 5.08,92.71 v26.04,92.71 26.89,91.86 SSA1:C1.1 27.3,89.75 SSA1:IC2.8 | SSA3:R2.2 3.81,40.64 SSA3:Q2.3 | v52.07,73.66 52.07,64.77 52.92,64.77 C10.1 53.79,64.8 56.11,64.8 | C9.+ 58.83,65.03 59.05,64.8 59.05,55.24 59.69,54.61 66.04,54.61 66.67,55.24 66.67,62.23 67.63,63.18 75.46,63.18 | C14.1 76.01,63.52 78.11,63.52 | C13.+ 78.33,63.52 IC4.3
ADC_B  (via drill 0.65 pad 1.52)
  Top 0.61: v28.58,36.2 v37.99,36.2
  Bottom 0.61: SSA3:IC2.7 27.94,41.27 28.58,40.64 SSA3:R4.1 v28.58,36.2 | v37.99,36.2 U$3.30
ADC_G  (via drill 0.65 pad 1.52)
  Top 0.61: v29.21,55.88 v36.83,55.88
  Bottom 0.61: SSA2:IC2.7 29.84,63.5 31.11,62.23 SSA2:R4.1 29.21,59.05 v29.21,55.88 | v36.83,55.88 37.01,55.88 38.91,53.98 U$3.16
ADC_I  (via drill 0.65 pad 1.52)
  Top 0.61: v30.48,13.97 v43.81,13.97
  Bottom 0.61: SSA4:IC2.7 29.21,19.05 30.48,17.78 SSA4:R4.1 v30.48,13.97 | v43.81,13.97 44.45,13.34 54.61,13.34 55.88,14.61 U$3.42
ADC_R  (via drill 0.65 pad 1.52)
  Top 0.61: v34.92,81.28 v41.91,81.28
  Bottom 0.61: SSA1:R4.1 31.11,85.09 28.58,85.09 | 28.58,85.09 SSA1:IC2.7 | 28.58,85.09 29.21,85.72 29.21,90.81 30.48,92.08 33.65,92.08 35.56,90.17 35.56,81.92 v34.92,81.28 | v41.91,81.28 42.55,80.64 42.55,67.31 41.91,66.67 U$3.6
BLUE  (via drill 0.7 pad 1.52)
  Top 0.61: v80.01,90.81 v80.01,84.89
  Bottom 0.61: v80.01,84.89 77.9,84.89 77.47,84.45 U$3.124 | TP7.TP 118.74,113.67
  Bottom 0.813: R12.2 119.38,116.2 118.74,115.57 118.74,113.67 118.74,93.34 117.84,92.44 80.38,92.44 80.01,92.08 v80.01,90.81
CLK
  Bottom 0.813: 73.02,40.01 TP1.TP | 73.66,23.5 U$3.55
  Bottom 1.016: IC1.4 73.02,40.01 | TP1.TP 74.3,39.37 74.3,25.4 73.66,24.77 73.66,23.5
DIS_B  (via drill 0.7 pad 1.52)
  Top 0.61: v30.05,30.48 v36.83,30.48
  Bottom 0.61: SSA3:Q4.G 13.97,31.11 27.3,31.11 27.94,30.48 v30.05,30.48 | v36.83,30.48 36.83,31.75 38.73,33.66 U$3.32
DIS_G  (via drill 0.7 pad 1.52)
  Top 0.61: v33.22,38.73 v37.67,38.73
  Bottom 0.61: SSA2:Q4.G 13.97,52.07 14.61,51.44 32.39,51.44 33.22,50.6 v33.22,38.73 | U$3.28 v37.67,38.73
DIS_I  (via drill 0.7 pad 1.52)
  Top 0.61: v59.05,13.95 v59.05,4.88
  Bottom 0.61: SSA4:Q4.G 12.7,7.62 13.33,6.99 36.83,6.99 38.94,4.88 v59.05,4.88 | U$3.44 58.42,14.58 v59.05,13.95
DIS_R
  Bottom 0.61: SSA1:Q4.G 13.97,74.3 14.61,73.66 29.21,73.66 29.91,74.36 29.91,78.04 30.61,78.74 34.92,78.74 35.56,78.11 35.56,72.39 38.73,69.22 U$3.4
GND  (via drill 0.65 pad 1.52, 0.7 pad 1.52, 0.75 pad 1.52, 0.75 pad 1.93)  (13 unrouted)
  Top 0.61: v64.14,56.52 v64.14,52.07 | v111.12,81.92 v111.12,67.94 | v27.94,3.17 v27.94,9.53 | v28.58,32.38 v28.58,26.09 | v31.75,90.17 v31.75,101.68 | v28.58,53.34 v28.58,47.62 | v31.11,53.34 v36.83,53.34 | v17.14,45.09 v17.14,53.98
  Top 0.813: v48.89,87 v57.15,87
  Bottom 0.61: IC3.1 64.14,64.52 | 52.7,51.44 51.43,51.44 U$3.17 | 8.25,101.68 U$4.GND | v31.75,101.68 13.97,101.68 | 85.73,63.25 IC4.1 90.14,63.52 1K.1 92.71,63.5 | 54.02,61.98 C9.- | 77.73,60.33 C13.- | C11.- 85.98,60.33 | 85.98,60.33 85.98,62.23 | C12.2 85.3,59.65 85.98,60.33 | 64.39,62.13 C15.- | 63.86,59.69 63.86,59.2 | 63.86,59.2 63.86,59.05 63.86,56.79 v64.14,56.52 | C16.2 63.86,59.2 | JTAG1.9 JTAG1.7 JTAG1.5 JTAG1.3 | 11.48,39 SSA3:C17.2 | SSA4:IC2.1 19.69,21.59 21.59,21.59 | 22.86,21.59 21.59,21.59 | 21.27,21.27 21.59,21.59 | 22.23,67.31 22.23,59.05 | 28.58,52.7 31.11,52.7 v31.11,53.34 31.11,57.78 33.02,59.69 33.02,64.14 31.11,66.04 29.84,66.04 28.58,67.31 28.58,70.48 27.94,71.12 10.8,71.12 10.26,71.66 10.26,75.66 9.52,76.39 9.52,80.64 8.25,81.92 SSA1:R3.1 | 28.58,52.7 20.32,52.7 20,53.02 20.06,53.09 SSA2:C5.- 19.69,55.62 | 28.58,9.53 v27.94,9.53 | v28.58,32.38 27.94,33.02 21.97,33.02 21.33,33.66 SSA4:C5.- 20.7,36.2 SSA3:IC2.4 | SSA3:R3.1 8.73,38.26 8.73,32.86 10.16,31.43 10.16,28.57 10.57,28.17 12.7,28.17 | 88.9,5.08 SL3.1 | v28.58,26.09 28.58,26.26 | 19.05,45.09 19.05,44.45 SSA3:IC2.1 | v28.58,53.34 28.58,52.7 | 9.84,53.66 9.84,53.34 | POWER_ON.K 15.24,104.78 15.24,102.95 | 114.62,111.44 114.93,111.76 | 25.18,89.32 25.08,89.22 | 20.06,78.11 SSA1:C5.- | 19.69,56.52 19.69,55.62 | 19.69,55.62 19.69,54.93 | SSA4:IC2.4 19.43,13.59 SSA3:C5.- | 88.27,6.35 88.27,5.08 | TP4.TP 11.43,101.68
  Bottom 0.813: C1.2 61.38,41.27 C2.2 | 51.43,51.44 51.43,50.8 | 63.5,51.44 52.7,51.44 52.07,51.44 U$3.17 | 2.54,112.39 2.9,112.04 RESET.3 RESET.4 14.05,112.04 15.24,110.85 15.24,104.78 | POWER_ON.K 15.24,102.95 13.97,101.68 | 13.97,101.68 13.89,101.6 31.67,101.6 v31.75,101.68 31.75,99.06 32.15,98.66 37.46,98.66 38.1,98.02 38.1,93.98 38.73,93.34 42.55,93.34 | 13.97,101.68 11.43,101.68 8.25,101.68 | v48.89,87 42.55,87 41.91,87.63 41.91,92.71 42.55,93.34 | 42.55,93.34 66.04,93.34 68.58,95.89 113.67,95.89 114.3,96.52 Q2.1 114.93,102.87 114.93,110.49 | 114.93,110.49 Q3.1 114.62,111.44 | Q1.1 114.93,120.02 114.93,111.76 114.93,110.49 | v57.15,87 57.79,87.63 71.76,87.63 72.39,87 U$3.128 | v31.75,90.17 32.83,90.17 33.65,89.34 33.65,83.52 28.16,78.02 28.16,76.2 27.3,75.35 27.3,75.25 20.32,75.25 20.06,75.5 SSA1:C5.- | SSA1:C1.2 25.18,89.32 | 22.23,87.63 23.49,87.63 25.08,89.22 | 22.23,87.63 SSA1:IC2.1 | SSA1:IC2.4 20.95,80.01 21.59,80.64 21.59,87 22.23,87.63 | SSA2:IC2.1 22.23,66.04 | 22.23,66.04 22.23,59.05 21.59,58.42 SSA2:IC2.4 | SSA2:IC2.4 19.69,56.52 | SSA2:C5.- 20.06,53.98 v17.14,53.98 | 22.23,66.04 22.23,67.31 22.86,67.94 SSA2:C1.2 | SSA2:Q4.S 12.7,57.78 13.33,58.42 SSA2:IC2.4 | U$3.26 38.73,41.27 37.46,42.55 37.46,52.7 v36.83,53.34 | v28.58,26.09 28.58,22.86 32.39,19.05 32.39,10.16 31.75,9.53 28.58,9.53 | SSA3:C5.- 19.43,9.78 20.32,8.89 27.3,8.89 v27.94,9.53 | v27.94,3.17 10.8,3.17 9.52,4.45 9.52,8.26 7.62,10.16 SSA4:R3.1 7.62,16.51 8.25,17.14 SSA4:C17.2 | SSA1:R3.1 SSA1:C17.2 | SSA1:Q4.S 12.7,79.38 13.33,80.01 SSA1:IC2.4 | SSA1:IC2.4 20.06,79.63 20.06,78.11 | SSA2:C17.2 8.67,61.59 8.25,61.17 SSA2:R3.1 8.25,55.24 9.84,53.66
  Bottom 0.813: v28.58,47.62 27.3,48.9 10.48,48.9 9.84,49.53 9.84,53.34 | SSA3:C1.2 24.55,45.51 22.86,43.81 21.59,43.81 | 21.59,43.81 SSA3:IC2.1 19.05,45.09 18.41,45.09 | v17.14,45.09 18.41,45.09 | 18.41,45.09 19.05,44.45 | SSA4:C5.- 20.95,35.94 20.95,43.18 21.59,43.81 | v28.58,26.09 28.58,26.35 | v28.58,26.09 26.57,28.09 26.21,28.09 26.13,28.17 12.7,28.17 | SSA4:C1.2 24.55,23.28 22.86,21.59 19.69,21.59 | 21.27,21.27 20.95,20.95 20.95,14.61 20.32,13.97 SSA4:IC2.4 12.06,13.97 11.43,13.34 SSA4:Q4.S | SL3.3 SL3.2 88.27,5.08 88.9,5.08 | SL3.1 88.27,6.35 88.27,13.34 87.63,13.97 74.3,13.97 73.66,14.61 U$3.56 | JTAG1.3 JTAG1.9 118.11,81.28 117.48,81.92 v111.12,81.92 | v111.12,67.94 U$3.106 | SSA3:Q4.S 12.06,35.56 12.7,36.2 SSA3:IC2.4 | SSA3:R3.1 8.52,39 11.48,39
  Bottom 1.016: U$4.GND 11.43,101.68 v31.75,101.68 | C9.- 55.5,61.59 U$3.9 | C10.2 54.02,61.98 | IC3.1 64.49,64.16 64.49,62.23 64.39,62.13 | C15.- 64.39,60.22 63.86,59.69 | 63.86,59.05 C16.2 63.86,58.91 63.86,56.79 | C14.2 75.56,60.74 75.98,60.33 77.73,60.33 | 78.74,52.07 78.11,52.7 C13.- | 78.74,52.07 92.71,52.07 93.34,52.7 | 93.34,52.7 93.34,62.87 92.71,63.5 92.68,63.52 IC4.1 85.98,62.99 85.98,62.23 C11.- 85.98,57.83 C12.2 | 78.74,52.07 v64.14,52.07 63.5,51.44 U$3.17 | 52.07,51.44 51.43,50.8 51.43,31.75 53.34,29.84 R10.1 66.67,27.62 67.31,28.25 67.31,33.02 | 67.31,33.02 67.31,39.37 65.4,41.27 61.38,41.27 | C1.2 C2.2 | IC1.7 67.95,32.38 67.31,33.02 | 93.34,52.7 93.34,38.1 93.98,37.47 U$3.81 | C4.2 80.01,44.45 80.27,44.2 C3.- 85.09,44.2 86.36,42.92 U$3.65
GREEN  (via drill 0.7 pad 1.52)
  Top 0.61: v69.85,93.34 v69.85,85.72
  Bottom 0.61: v69.85,85.72 U$3.130 | TP5.TP 116.2,124.46
  Bottom 0.813: v69.85,93.34 70.48,93.98 116.2,93.98 116.84,94.61 116.84,123.27 116.2,123.9 116.2,124.46 R4.2
INTENSITY  (via drill 0.7 pad 1.52)
  Top 0.61: v64.77,96.52 v64.77,85.52
  Bottom 0.61: v64.77,85.52 U$3.134 | R17.2 64.77,101.6 v64.77,96.52
INTENSITY5  (2 unrouted)
  Bottom 0.61: Q5.C 48.89,100.33 R16.2 46.36,97.54
N$1
  Bottom 0.61: 104.46,120.65 104.14,120.65
  Bottom 1.016: Q1.3 104.46,120.65 | 104.14,120.65 103.51,121.28 R1.1
N$2
  Bottom 1.016: R1.2 103.51,116.2 102.87,116.84 94.61,116.84 93.98,116.2 SL1.3
N$3
  Bottom 0.61: Q2.3 111.76,98.42 111.12,97.79 100.33,97.79 99.7,98.42 R2.1
N$4
  Bottom 0.813: R13.2 73.02,46.99 72.39,47.62 IC1.1 69.21,47.62 68.58,48.26 61.59,48.26 59.69,46.35 59.69,36.83 60.33,36.2 62.86,36.2 63.5,36.83 63.5,38.73 | C2.1 63.5,38.73 | 63.5,38.73 Q6.1
N$6
  Bottom 0.61: Q5.B R17.1
N$7
  Bottom 0.61: 109.22,111.12 109.06,111.28 | 107.47,112.87 107.31,113.03
  Bottom 1.016: Q3.3 109.22,111.12 | 109.06,111.28 107.47,112.87 | 107.31,113.03 R3.1
N$10
  Bottom 0.61: 106.05,103.5 106.36,103.5
  Bottom 1.016: SL1.1 106.05,103.5 | 106.36,103.5 106.68,103.5 107.31,102.87 R3.2
N$13
  Bottom 0.61: 112.08,127 112.39,127
  Bottom 1.016: R4.1 112.08,127 | 112.39,127 113.03,126.36 Q1.2
N$16
  Bottom 1.016: Q2.2 R11.1
N$17
  Bottom 0.61: 113.03,115.89 R12.1
  Bottom 1.016: Q3.2 113.03,115.89
N$18
  Bottom 1.016: R2.2 99.7,107.31 98.42,106.05 SL1.2
N$19
  Bottom 0.813: R13.1 73.02,43.18 72.39,42.55 IC1.3 IC1.2 66.67,45.09 66.36,45.41 R14.1
N$20
  Bottom 0.813: C1.1 Q6.2 64.45,44.13 R14.2
N$21
  Bottom 0.61: R5.1 32.39,113.03 Q4.2
N$23
  Bottom 1.016: SL2.1 SL2.2 SL2.3 SL2.1 | Q4.3 30.8,115.89 42.86,115.89 43.18,115.57 SL2.1
N$24
  Bottom 0.61: R6.1 35.56,101.6 31.75,105.41 POWER_ON.A
N$25
  Bottom 1.016: R8.2 U$3.37
N$26
  Bottom 0.61: U$3.38 50.48,16.82 R9.2
N$27
  Bottom 0.61: 53.34,23.5 U$3.39
  Bottom 1.016: R10.2 53.34,23.5
N$28  (via drill 2.79 pad 3.81)
  other vias: 120.02,125.73
N$29  (via drill 2.79 pad 3.81)
  other vias: 120.02,3.17
N$30  (via drill 2.79 pad 3.81)
  other vias: 3.17,125.73
N$31  (via drill 2.79 pad 3.81)
  other vias: 3.17,3.17
POT_B  (via drill 0.65 pad 1.52)
  Top 0.61: v36.2,11.43 v43.81,11.43
  Bottom 0.61: SSA3:IC2.3 17.78,37.47 10.8,37.47 10.16,36.83 10.16,33.02 11.43,31.75 11.43,30.48 12.06,29.84 26.67,29.84 27.3,29.21 28.58,29.21 36.2,21.59 v36.2,11.43 | SL3.5 79.37,12.06 78.74,12.7 67.95,12.7 66.67,11.43 v43.81,11.43
POT_G  (via drill 0.65 pad 1.52)
  Top 0.61: v76.83,8.26 v69.85,8.26
  Bottom 0.61: SSA2:IC2.3 19.05,60.96 17.78,59.69 10.8,59.69 10.16,59.05 10.16,55.21 11.43,53.94 11.43,50.8 12.06,50.16 31.11,50.16 31.75,49.53 31.75,34.29 33.34,32.7 33.34,29.21 39.37,23.18 39.37,18.41 40.01,17.78 40.01,9.53 41.27,8.26 v69.85,8.26 | v76.83,8.26 SL3.6
POT_I
  Bottom 0.61: SSA4:IC2.3 17.78,16.51 16.51,15.24 10.16,15.24 9.52,14.61 9.52,10.16 11.43,8.26 11.43,5.71 12.06,5.08 29.84,5.08 33.02,1.91 81.28,1.91 81.92,2.54 SL3.4
POT_R
  Bottom 0.61: SSA1:IC2.3 18.41,81.28 11.43,81.28 10.8,80.64 10.8,76.83 11.43,76.2 11.43,73.03 12.06,72.39 31.11,72.39 36.2,67.31 36.2,57.78 34.92,56.52 34.92,52.7 36.2,51.44 36.2,36.83 36.51,36.51 36.51,33.66 34.92,32.07 34.92,29.84 40.96,23.81 40.96,20 41.59,19.37 41.59,10.48 42.55,9.53 67.95,9.53 69.21,10.79 73.66,10.79 74.3,10.16 SL3.7
RED  (via drill 0.7 pad 1.52)
  Top 0.61: v85.73,90.6 v85.73,84.89
  Bottom 0.61: v85.73,84.89 85.93,85.09 86.99,85.09 87.63,84.45 U$3.116 | 120.65,91.44 120.02,90.81 120.02,90.6 | TP6.TP 120.65,105.41
  Bottom 0.813: v85.73,90.6 120.02,90.6 120.65,91.24 120.65,91.44 120.65,105.41 R11.2
RESET  (via drill 0.7 pad 1.52)  (1 unrouted)
  Top 0.61: v59.69,98.42 v59.69,85.09
  Bottom 0.61: 28.58,117.47 43.81,117.47 | v59.69,85.09 U$3.138
  Bottom 0.813: R15.1 5.72,118.75 5.72,116.64 | 5.72,116.64 RESET.1 RESET.2 | 2.54,116.2 2.97,116.64 5.72,116.64
  Bottom 1.016: v59.69,98.42 59.69,116.2 58.42,117.47 43.81,117.47 | RESET.2 14.68,116.56 15.6,117.47 28.58,117.47
SSA1:COMP
  Bottom 0.61: SSA1:R5.2 SSA1:IC2.2 | SSA1:Q1.1 17.78,87.63 SSA1:R5.2 | SSA1:R5.2 17.78,83.82 17.14,83.19 SSA1:C17.1
SSA1:N$2
  Bottom 0.61: SSA1:Q1.3 12.7,88.27 12.06,87.63 SSA1:R2.1
SSA1:N$3
  Bottom 0.61: SSA1:Q2.1 3.81,78.74 4.44,79.38 | 4.44,79.38 SSA1:Q2.2 | 4.44,79.38 SSA1:IC1.2
SSA1:N$4
  Bottom 0.61: SSA1:Q1.2 6.98,90.17 6.35,89.53 6.35,81.28 6.98,80.64 6.98,78.74 6.35,78.11 6.35,76.2 | SSA1:IC1.3 6.35,74.93 6.35,76.2 | SSA1:R3.2 6.98,75.56 6.35,76.2
SSA1:N$5
  Bottom 0.61: SSA1:Q4.D SSA1:R5.1
SSA2:COMP
  Bottom 0.61: SSA2:IC2.2 SSA2:R5.2 | SSA2:Q1.1 17.78,64.77 SSA2:R5.2 | SSA2:C17.1 16.51,61.59 17.78,62.87 SSA2:R5.2
SSA2:N$2
  Bottom 0.61: SSA2:Q1.3 12.7,66.04 12.06,65.41 SSA2:R2.1
SSA2:N$3
  Bottom 0.61: SSA2:Q2.1 3.81,57.15 SSA2:Q2.2 5.08,55.24 SSA2:IC1.2
SSA2:N$4
  Bottom 0.61: SSA2:R3.2 SSA2:IC1.3 6.98,53.98 6.98,59.05 6.35,59.69 6.35,61.59 6.98,62.23 6.98,66.67 8.25,67.94 SSA2:Q1.2
SSA2:N$5
  Bottom 0.61: SSA2:R5.1 15.88,55.88 SSA2:Q4.D
SSA3:COMP
  Bottom 0.61: SSA3:R5.2 SSA3:IC2.2 | SSA3:Q1.1 14.61,41.91 15.24,41.27 SSA3:R5.2 | SSA3:R5.2 17.14,40.64 15.88,39.37 SSA3:C17.1
SSA3:N$2
  Bottom 0.61: SSA3:Q1.3 SSA3:R2.1
SSA3:N$3
  Bottom 0.61: SSA3:Q2.2 5.08,36.2 SSA3:Q2.1 3.49,34.61 SSA3:IC1.2
SSA3:N$4
  Bottom 0.61: SSA3:IC1.3 6.03,31.11 SSA3:R3.2 7.62,31.75 7.62,36.83 6.35,38.1 6.35,45.09 6.98,45.72 SSA3:Q1.2
SSA3:N$5
  Bottom 0.61: SSA3:Q4.D SSA3:R5.1
SSA4:COMP
  Bottom 0.61: SSA4:R5.2 17.14,18.41 15.88,17.14 SSA4:C17.1 | SSA4:R5.2 SSA4:IC2.2 | SSA4:Q1.1 17.14,21.59 SSA4:R5.2
SSA4:N$2
  Bottom 0.61: SSA4:Q1.3 SSA4:R2.1
SSA4:N$3
  Bottom 0.61: SSA4:Q2.2 4.44,15.88 SSA4:IC1.2 2.54,15.24 SSA4:Q2.1
SSA4:N$4
  Bottom 0.61: SSA4:Q1.2 6.98,24.13 6.35,23.5 6.35,17.78 5.72,17.14 5.72,13.34 5.08,12.7 SSA4:IC1.3 4.44,8.89 5.72,7.62 SSA4:R3.2
SSA4:N$5
  Bottom 0.61: SSA4:Q4.D SSA4:R5.1
TCK  (via drill 0.75 pad 1.52)
  Top 0.61: v106.05,73.66 v91.44,73.66
  Bottom 0.61: 92.08,73.66 v91.44,73.66 | v106.05,73.66 109.86,73.66 111.76,71.75 JTAG1.4
  Bottom 1.016: U$3.109 95.25,74.3 94.61,73.66 92.08,73.66
TDI
  Bottom 0.61: JTAG1.8 109.86,76.83 109.22,77.47 109.22,86.36 108.58,87 75.56,87 74.93,87.63 74.93,88.9 74.3,89.53 53.98,89.53 52.7,88.27 52.7,85.09 52.07,84.45 41.91,84.45 40.01,82.55 U$3.2
TDO  (via drill 0.75 pad 1.52)
  Top 0.61: v106.05,76.2 100.26,76.2 v100.18,76.28
  Bottom 0.61: v106.05,76.2 107.31,76.2 107.95,75.56 111.12,75.56 112.39,74.3 JTAG1.6 | v100.18,76.28 99.7,75.79 U$3.107
TMS  (via drill 0.75 pad 1.52)
  Top 0.61: v46.36,89.53 v46.36,75.56
  Bottom 0.61: v46.36,75.56 U$3.1 | v46.36,89.53 46.36,90.81 46.99,91.44 76.2,91.44 76.83,90.81 76.83,88.9 77.47,88.27 120.02,88.27 121.29,87 121.29,61.59 120.65,60.96 116.2,60.96 115.57,61.59 JTAG1.2
(copper drawn outside any net)
  shapes: Bottom area x5

### Text on the board
Bottom: COLOR MIXER